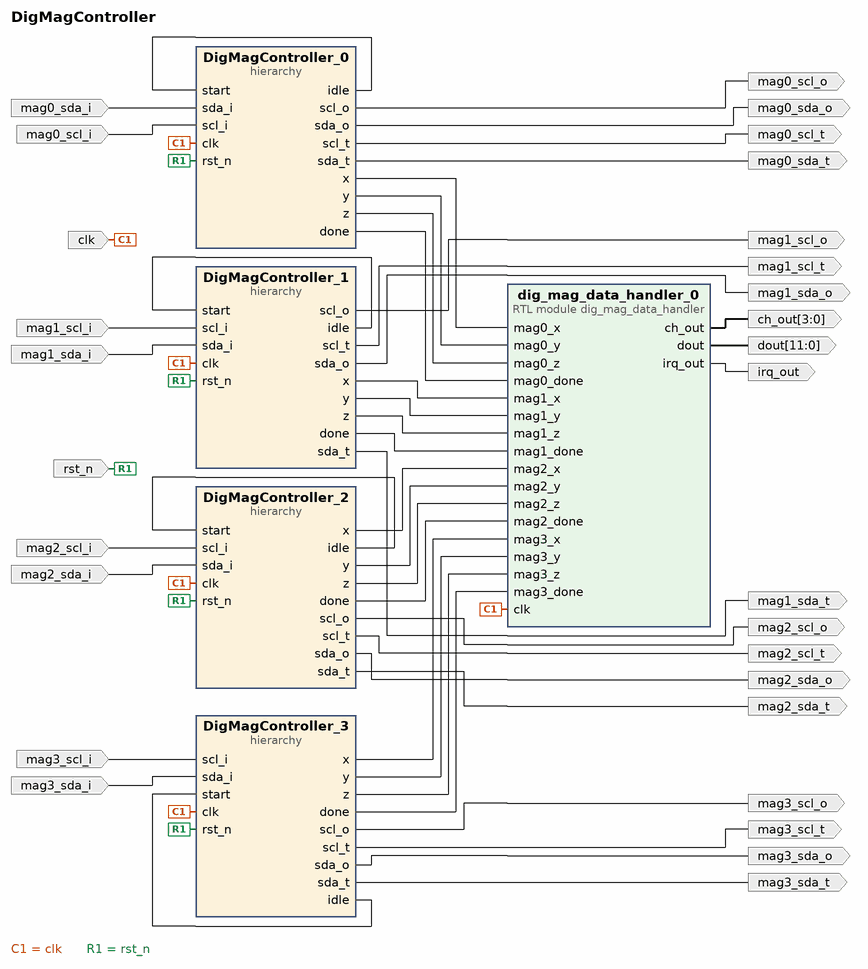
[diagram p0: block diagram of the top level]
# Vivado block design DigMagController, xczu3eg-sbva484-1-i, Vivado 2020.2
create_bd_design DigMagController

create_bd_port -dir I -type clk clk
create_bd_port -dir I -type rst rst_n
create_bd_port -dir I mag0_sda_i
create_bd_port -dir O mag0_sda_o
create_bd_port -dir O mag0_scl_o
create_bd_port -dir O mag0_scl_t
create_bd_port -dir I mag0_scl_i
create_bd_port -dir O mag0_sda_t
create_bd_port -dir I mag1_scl_i
create_bd_port -dir O mag1_scl_o
create_bd_port -dir O mag1_scl_t
create_bd_port -dir I mag1_sda_i
create_bd_port -dir O mag1_sda_o
create_bd_port -dir O mag1_sda_t
create_bd_port -dir I mag2_scl_i
create_bd_port -dir O mag2_scl_o
create_bd_port -dir O mag2_scl_t
create_bd_port -dir I mag2_sda_i
create_bd_port -dir O mag2_sda_o
create_bd_port -dir O mag2_sda_t
create_bd_port -dir I mag3_scl_i
create_bd_port -dir O mag3_scl_o
create_bd_port -dir O mag3_scl_t
create_bd_port -dir I mag3_sda_i
create_bd_port -dir O mag3_sda_o
create_bd_port -dir O mag3_sda_t
create_bd_port -dir O irq_out
create_bd_port -dir O -from 3 -to 0 ch_out
create_bd_port -dir O -from 11 -to 0 dout

create_bd_cell -type hier DigMagController_0
create_bd_cell -type hier DigMagController_1
create_bd_cell -type hier DigMagController_2
create_bd_cell -type hier DigMagController_3
create_bd_cell -type module -reference dig_mag_data_handler dig_mag_data_handler_0

# ---- hierarchy /DigMagController_0 ----
current_bd_instance /DigMagController_0
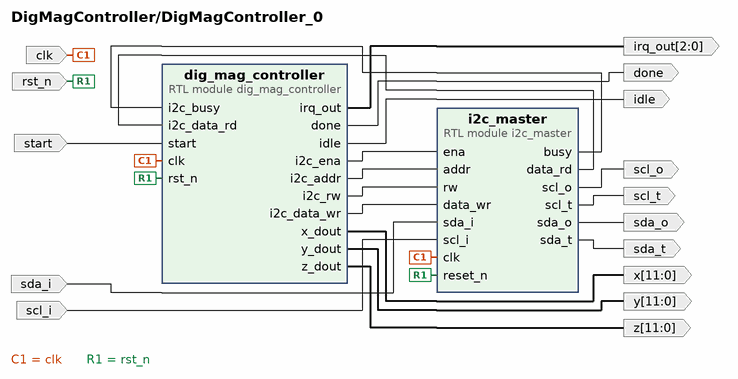
[diagram p1: block diagram inside /DigMagController_0]
create_bd_pin -dir I -type clk clk
create_bd_pin -dir I -type rst rst_n
create_bd_pin -dir O -from 2 -to 0 irq_out
create_bd_pin -dir O -from 11 -to 0 x
create_bd_pin -dir O -from 11 -to 0 y
create_bd_pin -dir O -from 11 -to 0 z
create_bd_pin -dir I start
create_bd_pin -dir O idle
create_bd_pin -dir O done
create_bd_pin -dir I sda_i
create_bd_pin -dir O sda_o
create_bd_pin -dir O sda_t
create_bd_pin -dir I scl_i
create_bd_pin -dir O scl_o
create_bd_pin -dir O scl_t

create_bd_cell -type module -reference i2c_master i2c_master
set_property -dict {CONFIG.bus_clk 100000} [get_bd_cells i2c_master]
create_bd_cell -type module -reference dig_mag_controller dig_mag_controller

# ---- hierarchy /DigMagController_1 ----
current_bd_instance /DigMagController_1
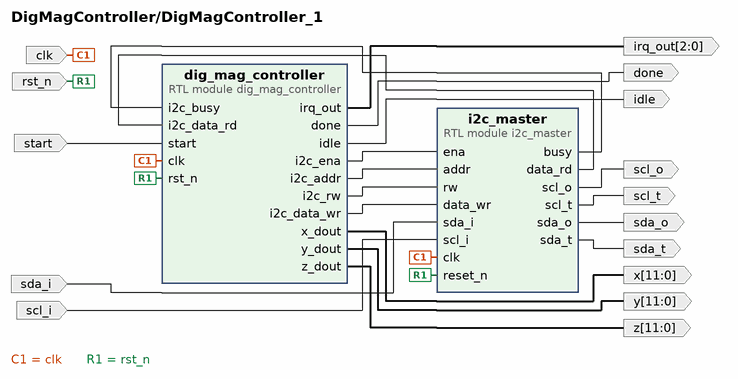
[diagram p2: block diagram inside /DigMagController_1]
create_bd_pin -dir I -type clk clk
create_bd_pin -dir I -type rst rst_n
create_bd_pin -dir O -from 2 -to 0 irq_out
create_bd_pin -dir O -from 11 -to 0 x
create_bd_pin -dir O -from 11 -to 0 y
create_bd_pin -dir O -from 11 -to 0 z
create_bd_pin -dir I start
create_bd_pin -dir O idle
create_bd_pin -dir O done
create_bd_pin -dir I sda_i
create_bd_pin -dir O sda_o
create_bd_pin -dir O sda_t
create_bd_pin -dir I scl_i
create_bd_pin -dir O scl_o
create_bd_pin -dir O scl_t

create_bd_cell -type module -reference i2c_master i2c_master
set_property -dict {CONFIG.bus_clk 100000} [get_bd_cells i2c_master]
create_bd_cell -type module -reference dig_mag_controller dig_mag_controller

# ---- hierarchy /DigMagController_2 ----
current_bd_instance /DigMagController_2
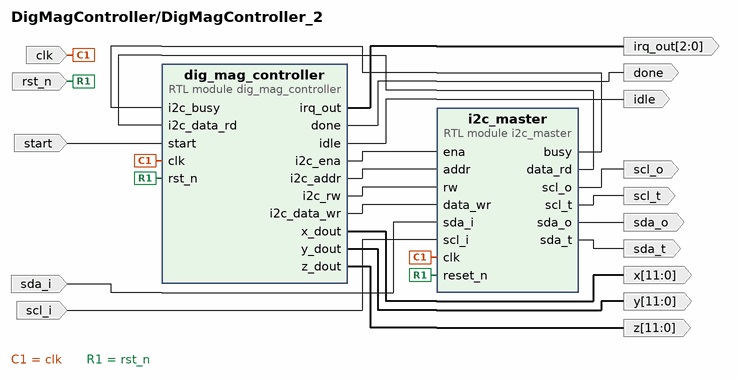
[diagram p3: block diagram inside /DigMagController_2]
create_bd_pin -dir I -type clk clk
create_bd_pin -dir I -type rst rst_n
create_bd_pin -dir O -from 2 -to 0 irq_out
create_bd_pin -dir O -from 11 -to 0 x
create_bd_pin -dir O -from 11 -to 0 y
create_bd_pin -dir O -from 11 -to 0 z
create_bd_pin -dir I start
create_bd_pin -dir O idle
create_bd_pin -dir O done
create_bd_pin -dir I sda_i
create_bd_pin -dir O sda_o
create_bd_pin -dir O sda_t
create_bd_pin -dir I scl_i
create_bd_pin -dir O scl_o
create_bd_pin -dir O scl_t

create_bd_cell -type module -reference i2c_master i2c_master
set_property -dict {CONFIG.bus_clk 100000} [get_bd_cells i2c_master]
create_bd_cell -type module -reference dig_mag_controller dig_mag_controller

# ---- hierarchy /DigMagController_3 ----
current_bd_instance /DigMagController_3
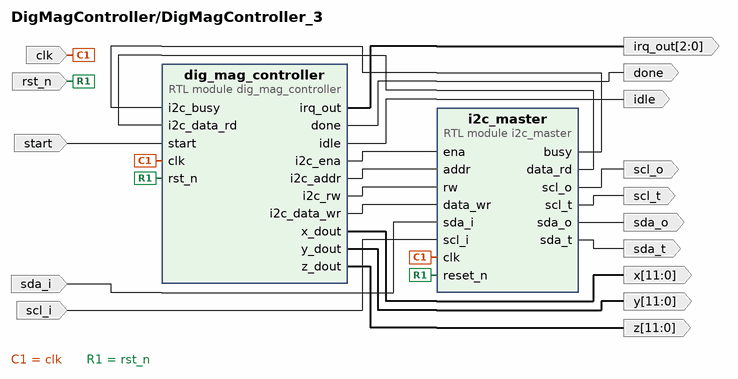
[diagram p4: block diagram inside /DigMagController_3]
create_bd_pin -dir I -type clk clk
create_bd_pin -dir I -type rst rst_n
create_bd_pin -dir O -from 2 -to 0 irq_out
create_bd_pin -dir O -from 11 -to 0 x
create_bd_pin -dir O -from 11 -to 0 y
create_bd_pin -dir O -from 11 -to 0 z
create_bd_pin -dir I start
create_bd_pin -dir O idle
create_bd_pin -dir O done
create_bd_pin -dir I sda_i
create_bd_pin -dir O sda_o
create_bd_pin -dir O sda_t
create_bd_pin -dir I scl_i
create_bd_pin -dir O scl_o
create_bd_pin -dir O scl_t

create_bd_cell -type module -reference i2c_master i2c_master
set_property -dict {CONFIG.bus_clk 100000} [get_bd_cells i2c_master]
create_bd_cell -type module -reference dig_mag_controller dig_mag_controller

# ---- connections ----

current_bd_instance /DigMagController_0
connect_bd_net -net dig_mag_controller_0_i2c_ena [get_bd_pins dig_mag_controller/i2c_ena] [get_bd_pins i2c_master/ena]
connect_bd_net -net dig_mag_controller_0_i2c_addr [get_bd_pins dig_mag_controller/i2c_addr] [get_bd_pins i2c_master/addr]
connect_bd_net -net dig_mag_controller_0_i2c_rw [get_bd_pins dig_mag_controller/i2c_rw] [get_bd_pins i2c_master/rw]
connect_bd_net -net dig_mag_controller_0_i2c_data_wr [get_bd_pins dig_mag_controller/i2c_data_wr] [get_bd_pins i2c_master/data_wr]
connect_bd_net -net i2c_master_0_busy [get_bd_pins i2c_master/busy] [get_bd_pins dig_mag_controller/i2c_busy]
connect_bd_net -net i2c_master_0_data_rd [get_bd_pins i2c_master/data_rd] [get_bd_pins dig_mag_controller/i2c_data_rd]
connect_bd_net -net clk_0_1 [get_bd_pins clk] [get_bd_pins i2c_master/clk] [get_bd_pins dig_mag_controller/clk]
connect_bd_net -net rst_n_0_1 [get_bd_pins rst_n] [get_bd_pins i2c_master/reset_n] [get_bd_pins dig_mag_controller/rst_n]
connect_bd_net -net dig_mag_controller_0_irq_out [get_bd_pins dig_mag_controller/irq_out] [get_bd_pins irq_out]
connect_bd_net -net dig_mag_controller_0_x_dout [get_bd_pins dig_mag_controller/x_dout] [get_bd_pins x]
connect_bd_net -net dig_mag_controller_0_y_dout [get_bd_pins dig_mag_controller/y_dout] [get_bd_pins y]
connect_bd_net -net dig_mag_controller_0_z_dout [get_bd_pins dig_mag_controller/z_dout] [get_bd_pins z]
connect_bd_net -net start_0_1 [get_bd_pins start] [get_bd_pins dig_mag_controller/start]
connect_bd_net -net dig_mag_controller_0_idle [get_bd_pins dig_mag_controller/idle] [get_bd_pins idle]
connect_bd_net -net dig_mag_controller_0_done [get_bd_pins dig_mag_controller/done] [get_bd_pins done]
connect_bd_net -net sda_i_0_1 [get_bd_pins sda_i] [get_bd_pins i2c_master/sda_i]
connect_bd_net -net i2c_master_0_sda_o [get_bd_pins i2c_master/sda_o] [get_bd_pins sda_o]
connect_bd_net -net i2c_master_0_sda_t [get_bd_pins i2c_master/sda_t] [get_bd_pins sda_t]
connect_bd_net -net scl_i_0_1 [get_bd_pins scl_i] [get_bd_pins i2c_master/scl_i]
connect_bd_net -net i2c_master_0_scl_o [get_bd_pins i2c_master/scl_o] [get_bd_pins scl_o]
connect_bd_net -net i2c_master_0_scl_t [get_bd_pins i2c_master/scl_t] [get_bd_pins scl_t]

current_bd_instance /DigMagController_1
connect_bd_net -net dig_mag_controller_0_i2c_ena [get_bd_pins dig_mag_controller/i2c_ena] [get_bd_pins i2c_master/ena]
connect_bd_net -net dig_mag_controller_0_i2c_addr [get_bd_pins dig_mag_controller/i2c_addr] [get_bd_pins i2c_master/addr]
connect_bd_net -net dig_mag_controller_0_i2c_rw [get_bd_pins dig_mag_controller/i2c_rw] [get_bd_pins i2c_master/rw]
connect_bd_net -net dig_mag_controller_0_i2c_data_wr [get_bd_pins dig_mag_controller/i2c_data_wr] [get_bd_pins i2c_master/data_wr]
connect_bd_net -net i2c_master_0_busy [get_bd_pins i2c_master/busy] [get_bd_pins dig_mag_controller/i2c_busy]
connect_bd_net -net i2c_master_0_data_rd [get_bd_pins i2c_master/data_rd] [get_bd_pins dig_mag_controller/i2c_data_rd]
connect_bd_net -net clk_0_1 [get_bd_pins clk] [get_bd_pins i2c_master/clk] [get_bd_pins dig_mag_controller/clk]
connect_bd_net -net rst_n_0_1 [get_bd_pins rst_n] [get_bd_pins i2c_master/reset_n] [get_bd_pins dig_mag_controller/rst_n]
connect_bd_net -net dig_mag_controller_0_irq_out [get_bd_pins dig_mag_controller/irq_out] [get_bd_pins irq_out]
connect_bd_net -net dig_mag_controller_0_x_dout [get_bd_pins dig_mag_controller/x_dout] [get_bd_pins x]
connect_bd_net -net dig_mag_controller_0_y_dout [get_bd_pins dig_mag_controller/y_dout] [get_bd_pins y]
connect_bd_net -net dig_mag_controller_0_z_dout [get_bd_pins dig_mag_controller/z_dout] [get_bd_pins z]
connect_bd_net -net start_0_1 [get_bd_pins start] [get_bd_pins dig_mag_controller/start]
connect_bd_net -net dig_mag_controller_0_idle [get_bd_pins dig_mag_controller/idle] [get_bd_pins idle]
connect_bd_net -net dig_mag_controller_0_done [get_bd_pins dig_mag_controller/done] [get_bd_pins done]
connect_bd_net -net sda_i_0_1 [get_bd_pins sda_i] [get_bd_pins i2c_master/sda_i]
connect_bd_net -net i2c_master_0_sda_o [get_bd_pins i2c_master/sda_o] [get_bd_pins sda_o]
connect_bd_net -net i2c_master_0_sda_t [get_bd_pins i2c_master/sda_t] [get_bd_pins sda_t]
connect_bd_net -net scl_i_0_1 [get_bd_pins scl_i] [get_bd_pins i2c_master/scl_i]
connect_bd_net -net i2c_master_0_scl_o [get_bd_pins i2c_master/scl_o] [get_bd_pins scl_o]
connect_bd_net -net i2c_master_0_scl_t [get_bd_pins i2c_master/scl_t] [get_bd_pins scl_t]

current_bd_instance /DigMagController_2
connect_bd_net -net dig_mag_controller_0_i2c_ena [get_bd_pins dig_mag_controller/i2c_ena] [get_bd_pins i2c_master/ena]
connect_bd_net -net dig_mag_controller_0_i2c_addr [get_bd_pins dig_mag_controller/i2c_addr] [get_bd_pins i2c_master/addr]
connect_bd_net -net dig_mag_controller_0_i2c_rw [get_bd_pins dig_mag_controller/i2c_rw] [get_bd_pins i2c_master/rw]
connect_bd_net -net dig_mag_controller_0_i2c_data_wr [get_bd_pins dig_mag_controller/i2c_data_wr] [get_bd_pins i2c_master/data_wr]
connect_bd_net -net i2c_master_0_busy [get_bd_pins i2c_master/busy] [get_bd_pins dig_mag_controller/i2c_busy]
connect_bd_net -net i2c_master_0_data_rd [get_bd_pins i2c_master/data_rd] [get_bd_pins dig_mag_controller/i2c_data_rd]
connect_bd_net -net clk_0_1 [get_bd_pins clk] [get_bd_pins i2c_master/clk] [get_bd_pins dig_mag_controller/clk]
connect_bd_net -net rst_n_0_1 [get_bd_pins rst_n] [get_bd_pins i2c_master/reset_n] [get_bd_pins dig_mag_controller/rst_n]
connect_bd_net -net dig_mag_controller_0_irq_out [get_bd_pins dig_mag_controller/irq_out] [get_bd_pins irq_out]
connect_bd_net -net dig_mag_controller_0_x_dout [get_bd_pins dig_mag_controller/x_dout] [get_bd_pins x]
connect_bd_net -net dig_mag_controller_0_y_dout [get_bd_pins dig_mag_controller/y_dout] [get_bd_pins y]
connect_bd_net -net dig_mag_controller_0_z_dout [get_bd_pins dig_mag_controller/z_dout] [get_bd_pins z]
connect_bd_net -net start_0_1 [get_bd_pins start] [get_bd_pins dig_mag_controller/start]
connect_bd_net -net dig_mag_controller_0_idle [get_bd_pins dig_mag_controller/idle] [get_bd_pins idle]
connect_bd_net -net dig_mag_controller_0_done [get_bd_pins dig_mag_controller/done] [get_bd_pins done]
connect_bd_net -net sda_i_0_1 [get_bd_pins sda_i] [get_bd_pins i2c_master/sda_i]
connect_bd_net -net i2c_master_0_sda_o [get_bd_pins i2c_master/sda_o] [get_bd_pins sda_o]
connect_bd_net -net i2c_master_0_sda_t [get_bd_pins i2c_master/sda_t] [get_bd_pins sda_t]
connect_bd_net -net scl_i_0_1 [get_bd_pins scl_i] [get_bd_pins i2c_master/scl_i]
connect_bd_net -net i2c_master_0_scl_o [get_bd_pins i2c_master/scl_o] [get_bd_pins scl_o]
connect_bd_net -net i2c_master_0_scl_t [get_bd_pins i2c_master/scl_t] [get_bd_pins scl_t]

current_bd_instance /DigMagController_3
connect_bd_net -net dig_mag_controller_0_i2c_ena [get_bd_pins dig_mag_controller/i2c_ena] [get_bd_pins i2c_master/ena]
connect_bd_net -net dig_mag_controller_0_i2c_addr [get_bd_pins dig_mag_controller/i2c_addr] [get_bd_pins i2c_master/addr]
connect_bd_net -net dig_mag_controller_0_i2c_rw [get_bd_pins dig_mag_controller/i2c_rw] [get_bd_pins i2c_master/rw]
connect_bd_net -net dig_mag_controller_0_i2c_data_wr [get_bd_pins dig_mag_controller/i2c_data_wr] [get_bd_pins i2c_master/data_wr]
connect_bd_net -net i2c_master_0_busy [get_bd_pins i2c_master/busy] [get_bd_pins dig_mag_controller/i2c_busy]
connect_bd_net -net i2c_master_0_data_rd [get_bd_pins i2c_master/data_rd] [get_bd_pins dig_mag_controller/i2c_data_rd]
connect_bd_net -net clk_0_1 [get_bd_pins clk] [get_bd_pins i2c_master/clk] [get_bd_pins dig_mag_controller/clk]
connect_bd_net -net rst_n_0_1 [get_bd_pins rst_n] [get_bd_pins i2c_master/reset_n] [get_bd_pins dig_mag_controller/rst_n]
connect_bd_net -net dig_mag_controller_0_irq_out [get_bd_pins dig_mag_controller/irq_out] [get_bd_pins irq_out]
connect_bd_net -net dig_mag_controller_0_x_dout [get_bd_pins dig_mag_controller/x_dout] [get_bd_pins x]
connect_bd_net -net dig_mag_controller_0_y_dout [get_bd_pins dig_mag_controller/y_dout] [get_bd_pins y]
connect_bd_net -net dig_mag_controller_0_z_dout [get_bd_pins dig_mag_controller/z_dout] [get_bd_pins z]
connect_bd_net -net start_0_1 [get_bd_pins start] [get_bd_pins dig_mag_controller/start]
connect_bd_net -net dig_mag_controller_0_idle [get_bd_pins dig_mag_controller/idle] [get_bd_pins idle]
connect_bd_net -net dig_mag_controller_0_done [get_bd_pins dig_mag_controller/done] [get_bd_pins done]
connect_bd_net -net sda_i_0_1 [get_bd_pins sda_i] [get_bd_pins i2c_master/sda_i]
connect_bd_net -net i2c_master_0_sda_o [get_bd_pins i2c_master/sda_o] [get_bd_pins sda_o]
connect_bd_net -net i2c_master_0_sda_t [get_bd_pins i2c_master/sda_t] [get_bd_pins sda_t]
connect_bd_net -net scl_i_0_1 [get_bd_pins scl_i] [get_bd_pins i2c_master/scl_i]
connect_bd_net -net i2c_master_0_scl_o [get_bd_pins i2c_master/scl_o] [get_bd_pins scl_o]
connect_bd_net -net i2c_master_0_scl_t [get_bd_pins i2c_master/scl_t] [get_bd_pins scl_t]

current_bd_instance /
connect_bd_net -net clk_0_1 [get_bd_ports clk] \
  [get_bd_pins DigMagController_0/clk] [get_bd_pins DigMagController_1/clk] [get_bd_pins DigMagController_2/clk] \
  [get_bd_pins DigMagController_3/clk] [get_bd_pins dig_mag_data_handler_0/clk]
connect_bd_net -net rst_n_0_1 [get_bd_ports rst_n] \
  [get_bd_pins DigMagController_0/rst_n] [get_bd_pins DigMagController_1/rst_n] [get_bd_pins DigMagController_2/rst_n] \
  [get_bd_pins DigMagController_3/rst_n]
connect_bd_net -net sda_i_0_1 [get_bd_ports mag0_sda_i] [get_bd_pins DigMagController_0/sda_i]
connect_bd_net -net i2c_master_0_sda_o [get_bd_pins DigMagController_0/sda_o] [get_bd_ports mag0_sda_o]
connect_bd_net -net i2c_master_0_scl_o [get_bd_pins DigMagController_0/scl_o] [get_bd_ports mag0_scl_o]
connect_bd_net -net i2c_master_0_scl_t [get_bd_pins DigMagController_0/scl_t] [get_bd_ports mag0_scl_t]
connect_bd_net -net scl_i_0_1 [get_bd_ports mag0_scl_i] [get_bd_pins DigMagController_0/scl_i]
connect_bd_net -net i2c_master_0_sda_t [get_bd_pins DigMagController_0/sda_t] [get_bd_ports mag0_sda_t]
connect_bd_net -net i2c_master_0_scl_o1 [get_bd_pins DigMagController_1/scl_o] [get_bd_ports mag1_scl_o]
connect_bd_net -net i2c_master_0_scl_t1 [get_bd_pins DigMagController_1/scl_t] [get_bd_ports mag1_scl_t]
connect_bd_net -net i2c_master_0_sda_o1 [get_bd_pins DigMagController_1/sda_o] [get_bd_ports mag1_sda_o]
connect_bd_net -net i2c_master_0_sda_t1 [get_bd_pins DigMagController_1/sda_t] [get_bd_ports mag1_sda_t]
connect_bd_net -net scl_i_0_2 [get_bd_ports mag1_scl_i] [get_bd_pins DigMagController_1/scl_i]
connect_bd_net -net sda_i_0_2 [get_bd_ports mag1_sda_i] [get_bd_pins DigMagController_1/sda_i]
connect_bd_net -net i2c_master_0_scl_o2 [get_bd_pins DigMagController_2/scl_o] [get_bd_ports mag2_scl_o]
connect_bd_net -net i2c_master_0_scl_o3 [get_bd_pins DigMagController_3/scl_o] [get_bd_ports mag3_scl_o]
connect_bd_net -net i2c_master_0_scl_t2 [get_bd_pins DigMagController_2/scl_t] [get_bd_ports mag2_scl_t]
connect_bd_net -net i2c_master_0_scl_t3 [get_bd_pins DigMagController_3/scl_t] [get_bd_ports mag3_scl_t]
connect_bd_net -net i2c_master_0_sda_o2 [get_bd_pins DigMagController_2/sda_o] [get_bd_ports mag2_sda_o]
connect_bd_net -net i2c_master_0_sda_o3 [get_bd_pins DigMagController_3/sda_o] [get_bd_ports mag3_sda_o]
connect_bd_net -net i2c_master_0_sda_t2 [get_bd_pins DigMagController_2/sda_t] [get_bd_ports mag2_sda_t]
connect_bd_net -net i2c_master_0_sda_t3 [get_bd_pins DigMagController_3/sda_t] [get_bd_ports mag3_sda_t]
connect_bd_net -net scl_i_0_3 [get_bd_ports mag2_scl_i] [get_bd_pins DigMagController_2/scl_i]
connect_bd_net -net scl_i_0_4 [get_bd_ports mag3_scl_i] [get_bd_pins DigMagController_3/scl_i]
connect_bd_net -net sda_i_0_3 [get_bd_ports mag2_sda_i] [get_bd_pins DigMagController_2/sda_i]
connect_bd_net -net sda_i_0_4 [get_bd_ports mag3_sda_i] [get_bd_pins DigMagController_3/sda_i]
connect_bd_net [get_bd_pins DigMagController_0/idle] [get_bd_pins DigMagController_0/start]
connect_bd_net [get_bd_pins DigMagController_1/idle] [get_bd_pins DigMagController_1/start]
connect_bd_net [get_bd_pins DigMagController_2/idle] [get_bd_pins DigMagController_2/start]
connect_bd_net [get_bd_pins DigMagController_3/idle] [get_bd_pins DigMagController_3/start]
connect_bd_net [get_bd_pins DigMagController_0/x] [get_bd_pins dig_mag_data_handler_0/mag0_x]
connect_bd_net [get_bd_pins DigMagController_0/y] [get_bd_pins dig_mag_data_handler_0/mag0_y]
connect_bd_net [get_bd_pins DigMagController_0/z] [get_bd_pins dig_mag_data_handler_0/mag0_z]
connect_bd_net [get_bd_pins DigMagController_0/done] [get_bd_pins dig_mag_data_handler_0/mag0_done]
connect_bd_net [get_bd_pins DigMagController_1/x] [get_bd_pins dig_mag_data_handler_0/mag1_x]
connect_bd_net [get_bd_pins DigMagController_1/y] [get_bd_pins dig_mag_data_handler_0/mag1_y]
connect_bd_net [get_bd_pins DigMagController_1/z] [get_bd_pins dig_mag_data_handler_0/mag1_z]
connect_bd_net [get_bd_pins DigMagController_2/x] [get_bd_pins dig_mag_data_handler_0/mag2_x]
connect_bd_net [get_bd_pins DigMagController_2/y] [get_bd_pins dig_mag_data_handler_0/mag2_y]
connect_bd_net [get_bd_pins DigMagController_2/z] [get_bd_pins dig_mag_data_handler_0/mag2_z]
connect_bd_net [get_bd_pins DigMagController_2/done] [get_bd_pins dig_mag_data_handler_0/mag2_done]
connect_bd_net [get_bd_pins DigMagController_1/done] [get_bd_pins dig_mag_data_handler_0/mag1_done]
connect_bd_net [get_bd_pins DigMagController_3/x] [get_bd_pins dig_mag_data_handler_0/mag3_x]
connect_bd_net [get_bd_pins DigMagController_3/y] [get_bd_pins dig_mag_data_handler_0/mag3_y]
connect_bd_net [get_bd_pins DigMagController_3/z] [get_bd_pins dig_mag_data_handler_0/mag3_z]
connect_bd_net [get_bd_pins DigMagController_3/done] [get_bd_pins dig_mag_data_handler_0/mag3_done]
connect_bd_net [get_bd_pins dig_mag_data_handler_0/irq_out] [get_bd_ports irq_out]
connect_bd_net [get_bd_pins dig_mag_data_handler_0/ch_out] [get_bd_ports ch_out]
connect_bd_net [get_bd_pins dig_mag_data_handler_0/dout] [get_bd_ports dout]

validate_bd_design
save_bd_design
